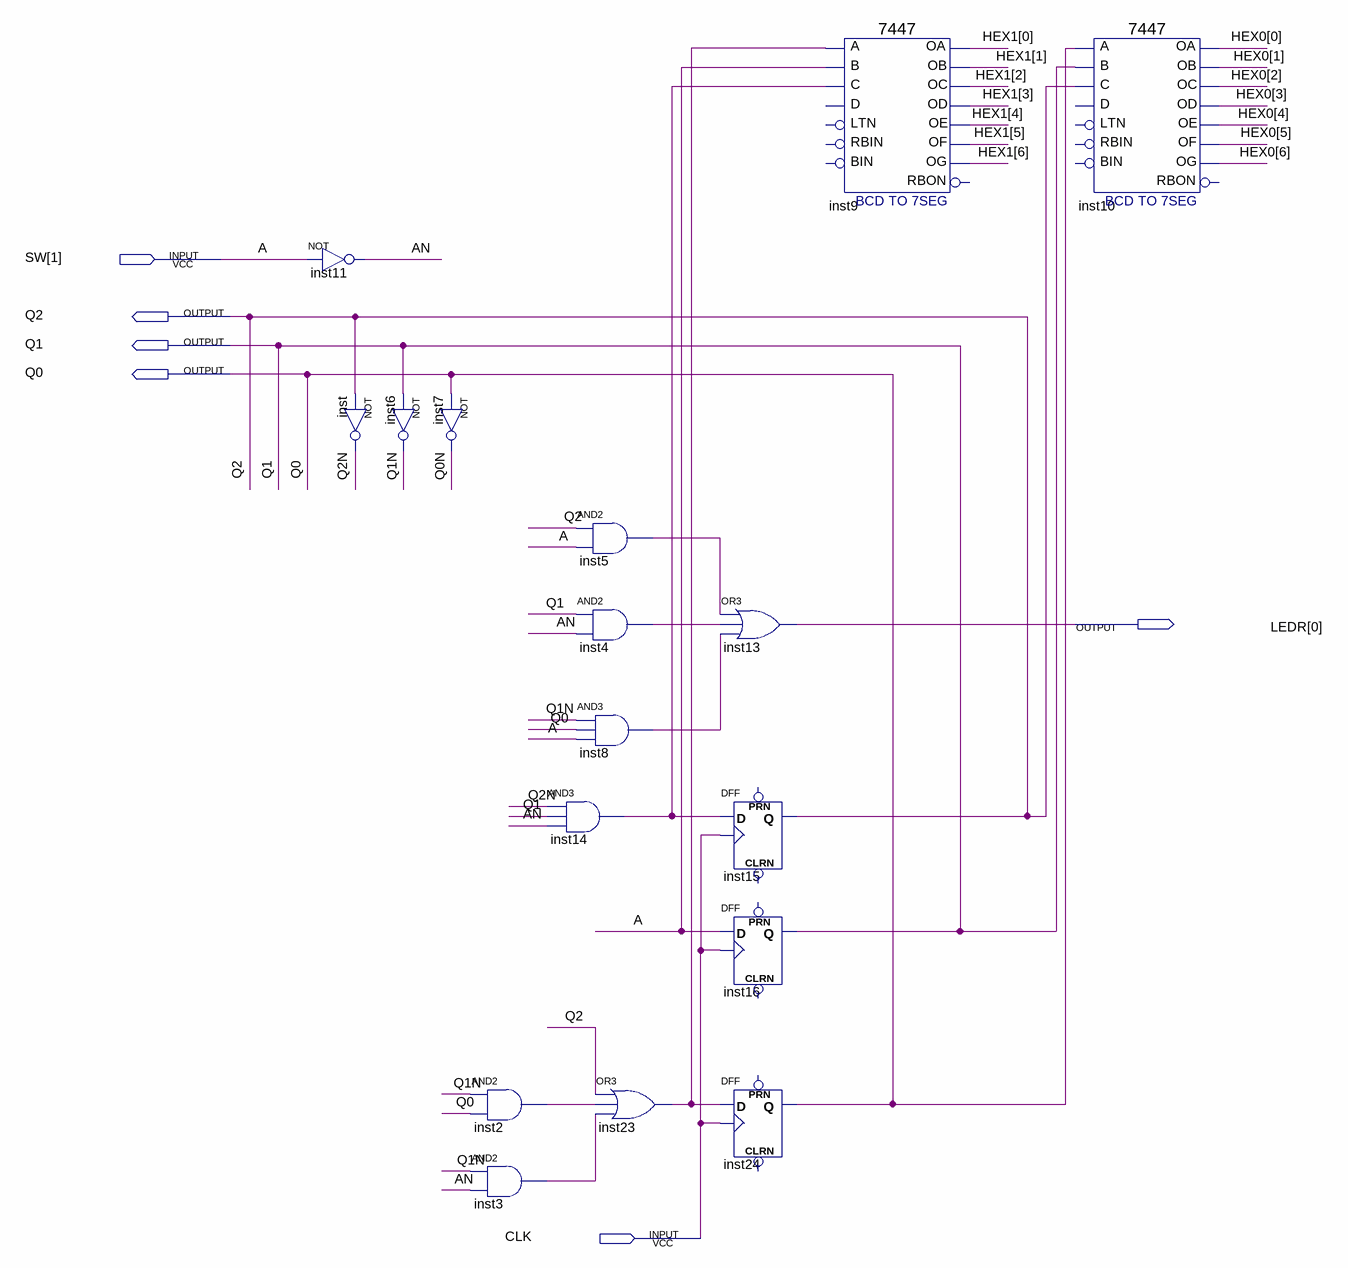
[diagram p0: schematic sheet]
// Quartus schematic LAB2_moore.bdf as structural Verilog: 17 symbols, 6 pins
module LAB2_moore (
  input  [1:1] SW,
  input  CLK,
  output Q2,
  output Q1,
  output Q0,
  output [0:0] LEDR
);

  wire AN, inst2_out, inst3_out, inst4_out, inst5_out, inst8_out, inst14_out, inst23_out, Q0N, Q1N, Q2N;
  wire [6:0] HEX0, HEX1;

  not inst11 (AN, SW[1]);
  not inst (Q2N, Q2);
  not inst6 (Q1N, Q1);
  not inst7 (Q0N, Q0);
  and inst2 (inst2_out, Q1N, Q0);
  and inst3 (inst3_out, Q1N, AN);
  and inst14 (inst14_out, Q2N, Q1, AN);
  and inst5 (inst5_out, Q2, SW[1]);
  and inst4 (inst4_out, Q1, AN);
  and inst8 (inst8_out, Q1N, Q0, SW[1]);
  or inst23 (inst23_out, Q2, inst2_out, inst3_out);
  or inst13 (LEDR[0], inst5_out, inst4_out, inst8_out);
  DFF inst15 (.CLK(CLK), .D(inst14_out), .Q(Q2));  // open: CLRN, PRN
  DFF inst16 (.CLK(CLK), .D(SW[1]), .Q(Q1));  // open: CLRN, PRN
  DFF inst24 (.CLK(CLK), .D(inst23_out), .Q(Q0));  // open: CLRN, PRN
  \7447  inst9 (
    .B(SW[1]), .C(inst14_out), .A(inst23_out), .OB(HEX1[1]), .OC(HEX1[2]), .OE(HEX1[4]), .OD(HEX1[3]),
    .OF(HEX1[5]), .OG(HEX1[6]), .OA(HEX1[0]));  // open: LTN, D, RBIN, BIN, RBON
  \7447  inst10 (
    .B(Q1), .C(Q2), .A(Q0), .OB(HEX0[1]), .OC(HEX0[2]), .OE(HEX0[4]), .OD(HEX0[3]), .OF(HEX0[5]),
    .OG(HEX0[6]), .OA(HEX0[0]));  // open: LTN, D, RBIN, BIN, RBON

  // Other names for the same wires on the sheet: A = SW[1]
endmodule
